# Altium schematic sheet Sheet1.SchDoc
size A4; SheetNumber: 1; SheetTotal: 1; SPICEModelCachePSEFRUIS: <root> / <DocumentId>PSEFRUIS</DocumentId> / </root>
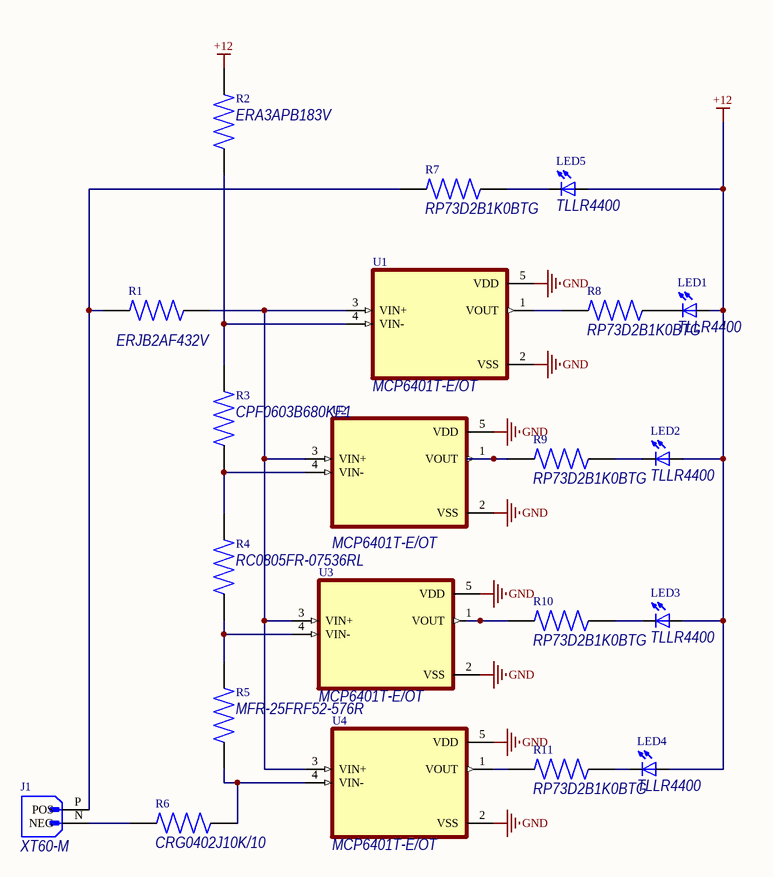
[diagram p0: Sheet1.SchDoc]

## Parts
J1  XT60-M  [AMASS_XT60-M]
LED1  TLLR4400  [LED3MM]
LED2  TLLR4400  [LED3MM]
LED3  TLLR4400  [LED3MM]
LED4  TLLR4400  [LED3MM]
LED5  TLLR4400  [LED3MM]
R1  ERJB2AF432V  [RES_ERJB2AF432V]
R2  ERA3APB183V  [RES_ERA3APB183V]
R3  CPF0603B680KE1  [RESC1508X55N]
R4  RC0805FR-07536RL  [RESC2012X60N]
R5  MFR-25FRF52-576R  [RESAD1100W55L680D260]
R6  CRG0402J10K/10  [RESC1005X40N]
R7  RP73D2B1K0BTG  [RESC3015X65N]
R8  RP73D2B1K0BTG  [RESC3015X65N]
R9  RP73D2B1K0BTG  [RESC3015X65N]
R10  RP73D2B1K0BTG  [RESC3015X65N]
R11  RP73D2B1K0BTG  [RESC3015X65N]
U1  MCP6401T-E/OT  [SOT95P270X145-5N]
U2  MCP6401T-E/OT  [SOT95P270X145-5N]
U3  MCP6401T-E/OT  [SOT95P270X145-5N]
U4  MCP6401T-E/OT  [SOT95P270X145-5N]

## Nets
+12: LED1.A LED2.A LED3.A LED4.A LED5.A R2.2
GND: U1.2(VSS) U1.5(VDD) U2.2(VSS) U2.5(VDD) U3.2(VSS) U3.5(VDD) U4.2(VSS) U4.5(VDD)
NetJ1_N: J1.N(NEG) R6.1
NetJ1_P: J1.P(POS) R1.1 R7.1
NetLED1_K: LED1.K(C) R8.2
NetLED2_K: LED2.K(C) R9.2
NetLED3_K: LED3.K(C) R10.2
NetLED4_K: LED4.K(C) R11.2
NetLED5_K: LED5.K(C) R7.2
NetR1_2: R1.2 U1.3(VIN+) U2.3(VIN+) U3.3(VIN+) U4.3(VIN+)
NetR2_1: R2.1 R3.2 U1.4(VIN-)
NetR3_1: R3.1 R4.2 U2.4(VIN-)
NetR4_1: R4.1 R5.2 U3.4(VIN-)
NetR5_1: R5.1 R6.2 U4.4(VIN-)
NetR8_1: R8.1 U1.1(VOUT)
NetR9_1: R9.1 U2.1(VOUT)
NetR10_1: R10.1 U3.1(VOUT)
NetR11_1: R11.1 U4.1(VOUT)

## Library data of the parts
J1 = XT60-M: Plug; DC supply; XT60; male; PIN: 2; for cable; soldered; 30A; 500V; MF: AMASS; SnapEDA_Link: https://www.snapeda.com/parts/XT60-M/AMASS/view-part/?ref=snap; Package: Package; Value: *; MP: XT60-M; Check_prices: https://www.snapeda.com/parts/XT60-M/AMASS/view-part/?ref=eda
LED1-LED5 = TLLR4400: Red 619nm LED Indication - Discrete 1.9V Radial; MF: Vishay; SnapEDA_Link: https://www.snapeda.com/parts/TLLR4400/Vishay+Semiconductor+Opto+Division/view-part/?ref=snap; Package: None; Value: *; MP: TLLR4400; Check_prices: https://www.snapeda.com/parts/TLLR4400/Vishay+Semiconductor+Opto+Division/view-part/?ref=eda
R2 = ERA3APB183V: Value: 18k; Availability: Unavailable; MP: ERA3APB183V; Package: None; Price: None
R3 = CPF0603B680KE1: 680 kOhms Â±0.1% 0.063W, 1/16W Chip Resistor 0603 (1608 Metric) Thin Film; Power_Rating: .063 W; Resistance: 750K; MF: TE Connectivity; Voltage_Rating: 50 V; Tolerance: .1%; SnapEDA_Link: https://www.snapeda.com/parts/CPF0603B680KE1/TE+Connectivity/view-part/?ref=snap; Package: 0603; Value: *; MP: CPF0603B680KE1; EU_RoHS_Compliance: Compliant; Check_prices: https://www.snapeda.com/parts/CPF0603B680KE1/TE+Connectivity/view-part/?ref=eda
R4 = RC0805FR-07536RL: 536 Ohms Â±1% 0.125W, 1/8W Chip Resistor 0805 (2012 Metric) Moisture Resistant Thick Film; MF: Yageo; SnapEDA_Link: https://www.snapeda.com/parts/RC0805FR-07536RL/Yageo/view-part/?ref=snap; Package: 2012 Yageo; Value: *; MP: RC0805FR-07536RL; Check_prices: https://www.snapeda.com/parts/RC0805FR-07536RL/Yageo/view-part/?ref=eda
R5 = MFR-25FRF52-576R: 576 Ohms Â±1% 0.25W, 1/4W Through Hole Resistor Axial - Metal Film; MF: Yageo; SnapEDA_Link: https://www.snapeda.com/parts/MFR-25FRF52-576R/Yageo/view-part/?ref=snap; Package: RADIAL-2 YAGEO; Value: *; MP: MFR-25FRF52-576R; Check_prices: https://www.snapeda.com/parts/MFR-25FRF52-576R/Yageo/view-part/?ref=eda
R6 = CRG0402J10K/10: CRG0402 chip resistor,10K 5% 0.063W | TE Connectivity CRG0402J10K/10; Power_Rating: .063 W; Voltage_Rating: 50 V; SnapEDA_Link: https://www.snapeda.com/parts/CRG0402J10K/10/TE+Connectivity+Passive+Product/view-part/?ref=snap; Package: 0402; Resistance: 10K; Value: *; MF: TE Connectivity; MP: CRG0402J10K/10; EU_RoHS_Compliance: Compliant with Exemptions; Tolerance: 5%; Check_prices: https://www.snapeda.com/parts/CRG0402J10K/10/TE+Connectivity+Passive+Product/view-part/?ref=eda
R7-R11 = RP73D2B1K0BTG: Res Thin Film 1206 1K Ohm 0.1% 0.25W(1/4W) Â±15ppm/C Epoxy Pad SMD Medical T/R; Power_Rating: .25 W; MF: TE Connectivity; Voltage_Rating: 200 V; Tolerance: .1%; SnapEDA_Link: https://www.snapeda.com/parts/RP73D2B1K0BTG/TE+Connectivity/view-part/?ref=snap; Package: 1206; Resistance: 1K; Value: *; MP: RP73D2B1K0BTG; EU_RoHS_Compliance: Compliant; Check_prices: https://www.snapeda.com/parts/RP73D2B1K0BTG/TE+Connectivity/view-part/?ref=eda
U1-U4 = MCP6401T-E/OT: General Purpose Amplifier 1 Circuit Rail-to-Rail SOT-23-5; MF: Microchip; Package: SOT-23-5 Microchip; MP: MCP6401T-E/OT; Value: *; Digi-Key_Part_Number: MCP6401T-E/OTCT-ND; Check_prices: https://www.snapeda.com/parts/MCP6401T-E/OT/Microchip/view-part/345712/?ref=eda; SnapEDA_Link: https://www.snapeda.com/parts/MCP6401T-E/OT/Microchip/view-part/345712/?ref=snap
R1 = ERJB2AF432V: Value: *; Availability: Unavailable; Package: None; Price: None; MP: ERJB2AF432V